# EAGLE design Button (EAGLE 7.1.0)
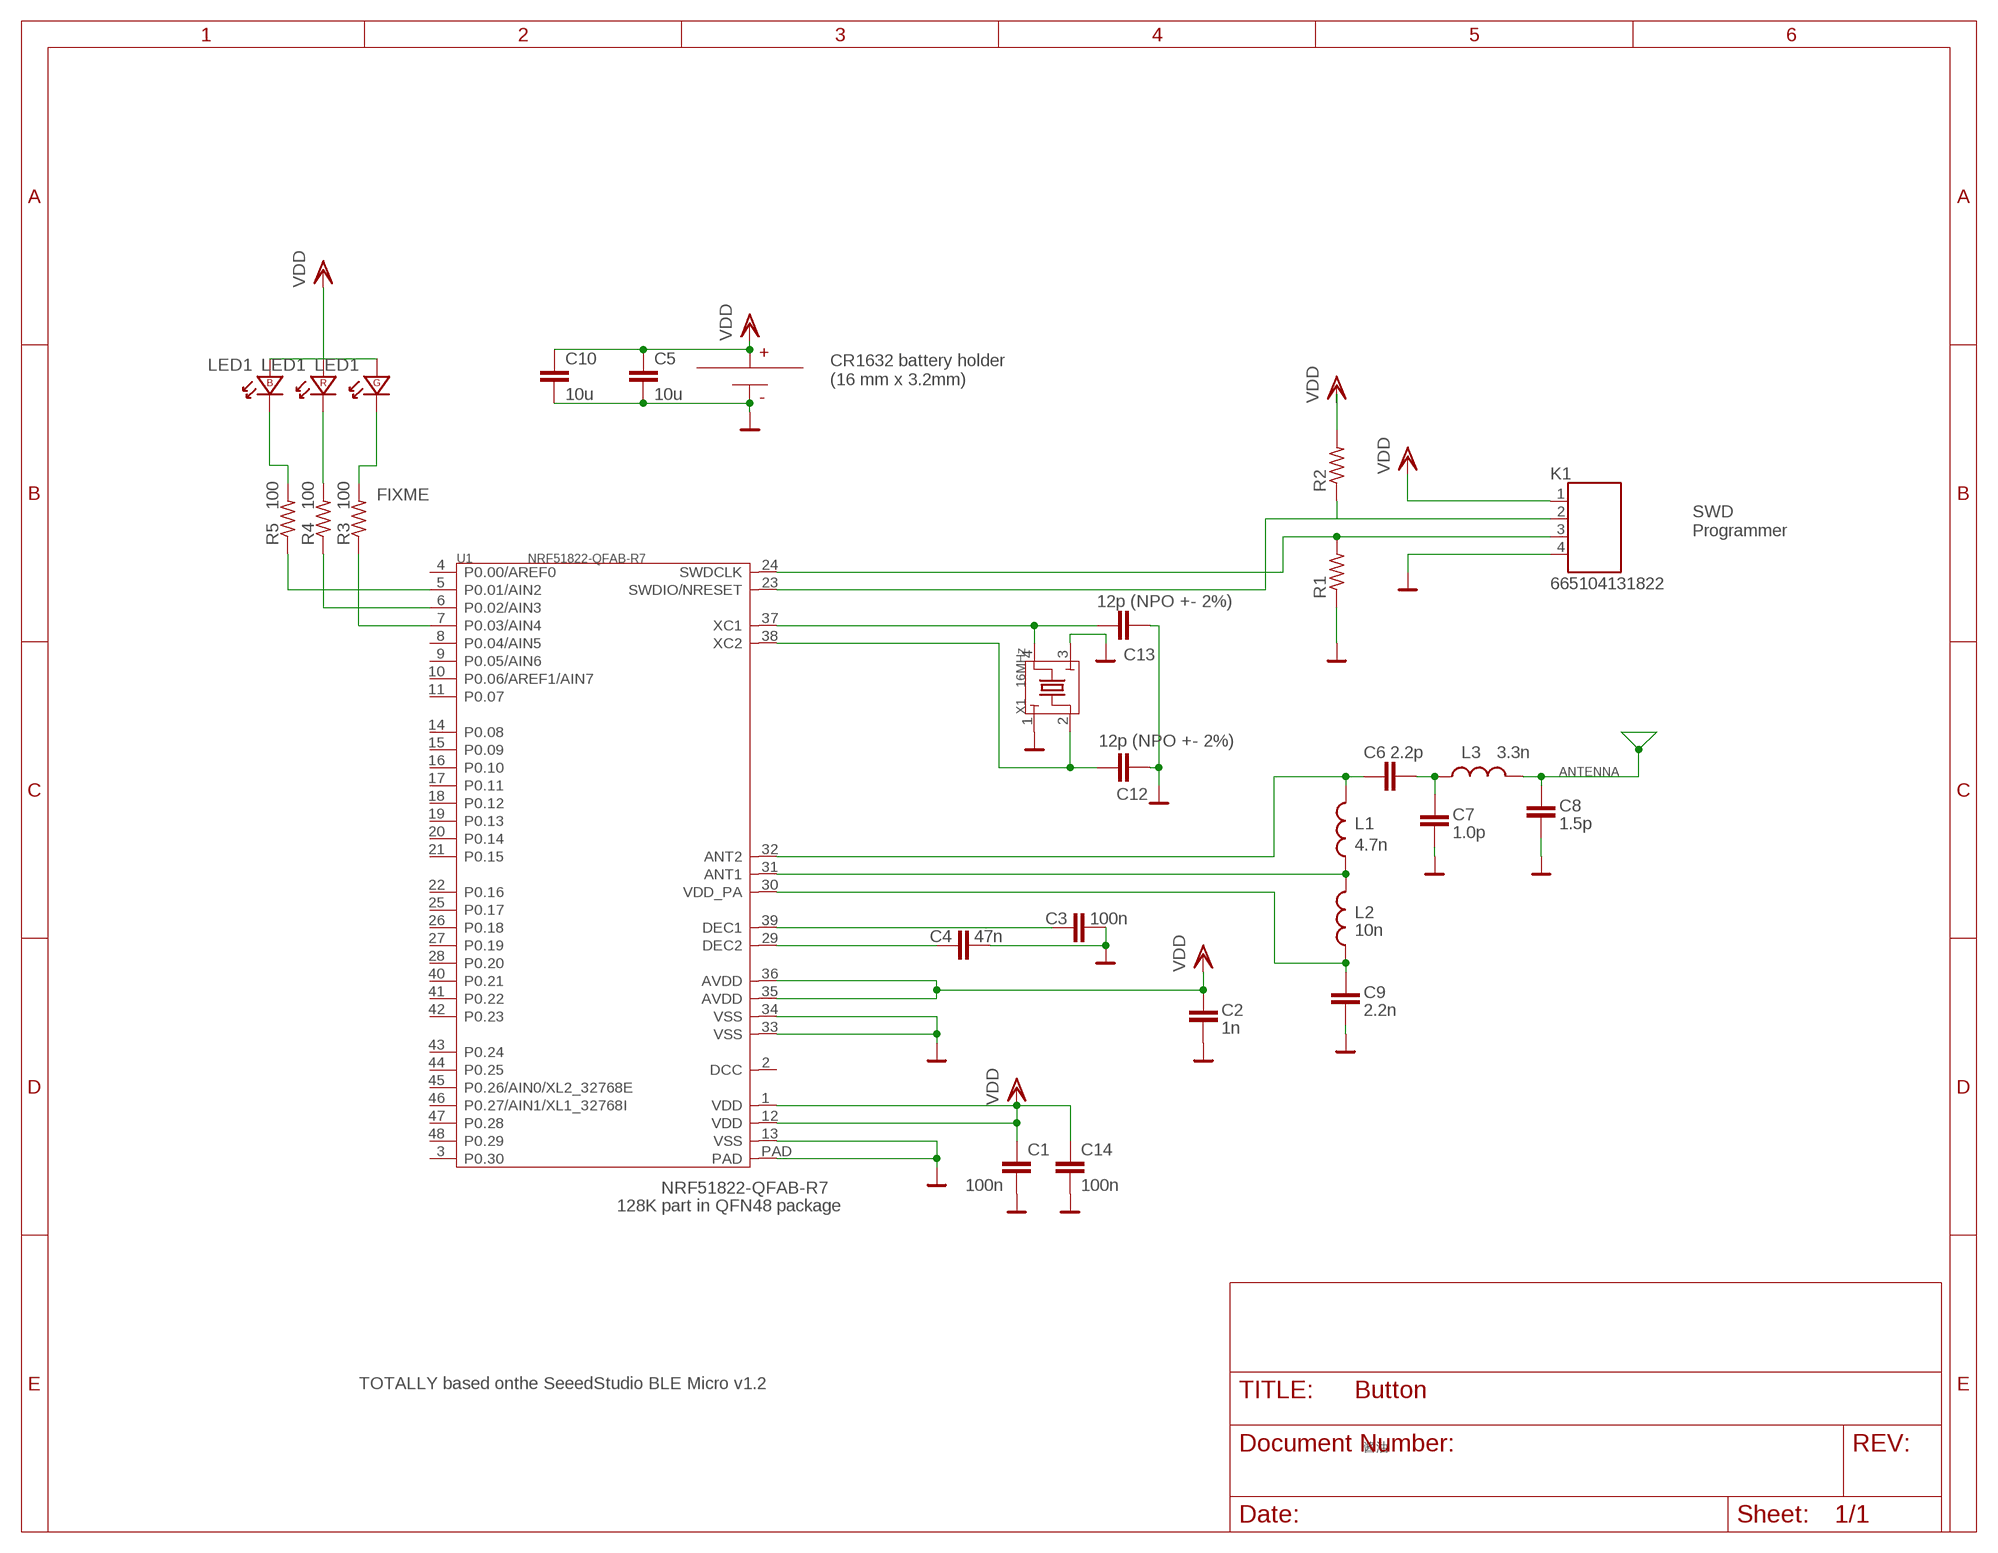
[diagram p0: schematic, sheet 1]

## Parts
B1  CON-COINCEL-HOLDER-KEYSTONE-3012TR  [16MM-COINCELL-KEYSTONE]
C1  100n  C-EU0402-C-NOSILK  [.0402-C-NOSILK]
C2  1n  C-EU0402-C-NOSILK  [.0402-C-NOSILK]
C3  100n  C-EU0402-C-NOSILK  [.0402-C-NOSILK]
C4  47n  C-EU0402-C-NOSILK  [.0402-C-NOSILK]
C5  10u  C-EU0805-B-NOSILK  [.0805-B-NOSILK]
C6  2.2p  C-EU0402-C-NOSILK  [.0402-C-NOSILK]
C7  1.0p  C-EU0402-C-NOSILK  [.0402-C-NOSILK]
C8  1.5p  C-EU0402-C-NOSILK  [.0402-C-NOSILK]
C9  2.2n  C-EU0402-C-NOSILK  [.0402-C-NOSILK]
C10  10u  C-EU0805-B-NOSILK  [.0805-B-NOSILK]
C12  12p (NPO +- 2%)  C-EU0402-C-NOSILK  [.0402-C-NOSILK]
C13  12p (NPO +- 2%)  C-EU0402-C-NOSILK  [.0402-C-NOSILK]
C14  100n  C-EU0402-C-NOSILK  [.0402-C-NOSILK]
K1  665104131822  [665104131822]
L1  4.7n  L-US0402-C-NOSILK  [.0402-C-NOSILK]
L2  10n  L-US0402-C-NOSILK  [.0402-C-NOSILK]
L3  3.3n  L-US0402-C-NOSILK  [.0402-C-NOSILK]
LED1  LED-RGB-SEPARATE-3528  [LED-3528]
R1  R-US_R0402  [R0402]
R2  R-US_R0402  [R0402]
R3  100  R-US_0402-C-NOSILK  [.0402-C-NOSILK]
R4  100  R-US_0402-C-NOSILK  [.0402-C-NOSILK]
R5  100  R-US_0402-C-NOSILK  [.0402-C-NOSILK]
U1  NRF51822-QFAB-R7  NRF51822  [QFN48-6X6MM]
X1  16MHz  CRYSTAL'-2520'  [2520]

## Nets
ANTENNA: C8.2 L3.2
GND: B1.NEG C1.2 C2.2 C3.2 C4.2 C5.2 C7.1 C8.1 C9.2 C10.2 C12.2 C13.2 C14.2 K1.4 R1.1 U1.13(VSS) U1.33(VSS) U1.34(VSS) U1.PAD X1.1 X1.3
N$1: R5.1 U1.5(P0.01/AIN2)
N$2: R4.1 U1.6(P0.02/AIN3)
N$3: R3.1 U1.7(P0.03/AIN4)
N$4: LED1.6(B:K) R5.2
N$5: LED1.5(R:K) R4.2
N$7: LED1.4(G:K) R3.2
N$9: K1.3 R1.2 U1.24(SWDCLK)
N$11: K1.2 R2.1 U1.23(SWDIO/NRESET)
N$14: R2.2
N$17: C13.1 U1.37(XC1) X1.4
N$18: C12.1 U1.38(XC2) X1.2
N$19: C3.1 U1.39(DEC1)
N$20: C4.1 U1.29(DEC2)
N$21: C6.1 L1.2 U1.32(ANT2)
N$25: L1.1 L2.2 U1.31(ANT1)
N$26: C9.1 L2.1 U1.30(VDD_PA)
N$28: C6.2 C7.2 L3.1
VDD: B1.POS@1(POS) B1.POS@2(POS) C1.1 C2.1 C5.1 C10.1 C14.1 K1.1 LED1.1(B:A) LED1.2(R:A) LED1.3(G:A) U1.1(VDD) U1.12(VDD) U1.35(AVDD) U1.36(AVDD)
Unconnected: U1.2(DCC) U1.3(P0.30) U1.4(P0.00/AREF0) U1.8(P0.04/AIN5) U1.9(P0.05/AIN6) U1.10(P0.06/AREF1/AIN7) U1.11(P0.07) U1.14(P0.08) U1.15(P0.09) U1.16(P0.10) U1.17(P0.11) U1.18(P0.12) U1.19(P0.13) U1.20(P0.14) U1.21(P0.15) U1.22(P0.16) U1.25(P0.17) U1.26(P0.18) U1.27(P0.19) U1.28(P0.20) U1.40(P0.21) U1.41(P0.22) U1.42(P0.23) U1.43(P0.24) U1.44(P0.25) U1.45(P0.26/AIN0/XL2_32768E) U1.46(P0.27/AIN1/XL1_32768I) U1.47(P0.28) U1.48(P0.29)

## Notes on the sheet
- CR1632 battery holder
  (16 mm x 3.2mm)
- FIXME
- SWD
  Programmer
- NRF51822-QFAB-R7
- 128K part in QFN48 package
- TOTALLY based onthe SeeedStudio BLE Micro v1.2
- 酱油

## Library data of the parts
B1 = 16mm-coincell-keystone:CON-COINCEL-HOLDER-KEYSTONE-3012TR
C1-C10 C12-C14 = rcl_custom:C-EU: CAPACITOR, European symbol
K1 = Wurth_Elektronik_Electromechanic_Wire_to_Board_Connectors_rev15c:665104131822: WR-WTB Wire-to-Board Connectors 1.00 mm SMT Male Horizontal Shrouded Header, 4 pins - Tape & Reel ;=>Code : Con_WTB_1_TermH_6651xx131822_665104131822 <http://katalog.we-online.de/media/images/eican/Con_WTB_1_TermH_6651xx131822_pf2.jpg> Details see: http://katalog.we-online.de/em/datasheet/6651xx131822.pdf Created 2014-10-08, Karrer Zheng 2014 (C) Wurth Elektronik
L1-L3 = rcl_custom:L-US: INDUCTOR, American symbol
LED1 = rgb-led-separate:LED-RGB-SEPARATE-*: RGB LED with separate contacts for all 3 chips
R1 R2 = adafruit:R-US_: RESISTOR, American symbol
R3-R5 = rcl_custom:R-US_: RESISTOR, American symbol
U1 = AMLib:NRF51822: Multi-protocol Blutooth 4.0 low energy /2. GHz RF SoC
X1 = AMLib:CRYSTAL

## Net classes
0 default: width 0.102 mm, drill 0.203 mm, clearance 0.102 mm

## Board
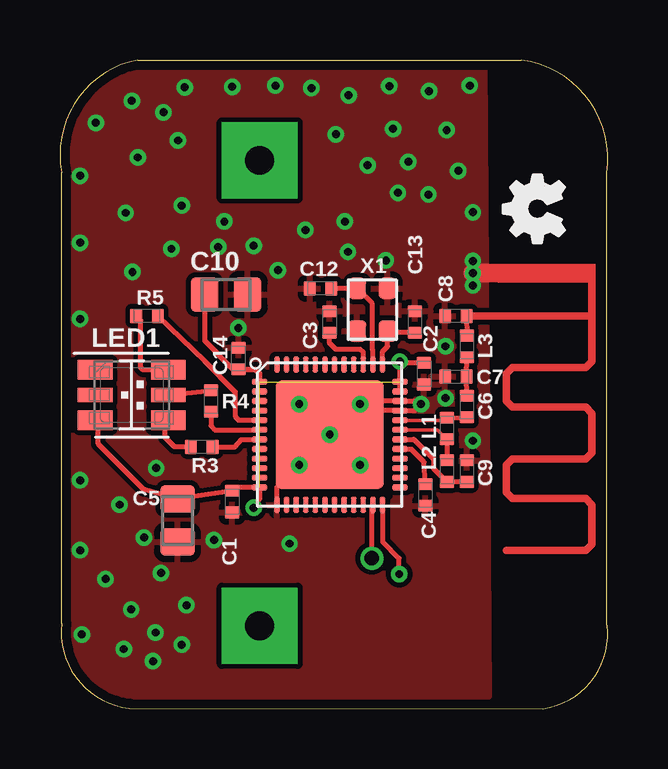
[diagram p1: board, top side]
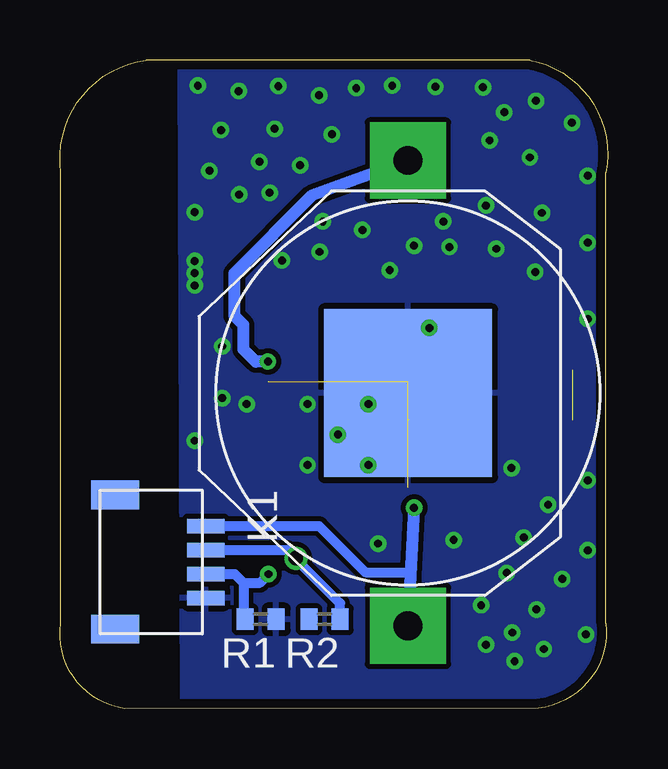
[diagram p2: board, bottom side, seen from below]

Size 22.84 x 27.05 mm. Coordinates in mm from the lower left corner, seen from the top.
Outline: 2.89,0.02 20.14,0 arc90 22.81,3.56 22.81,22.35 arc90 19.25,27.05 3.25,27.05 arc90 0.07,22.35 0.07,3.56 arc90 2.89,0.02
Copper layers (1*16): Top 0.0356mm / dielectric 1.5011mm / Bottom 0.0356mm
Design rules "OSH-Park-2-layer *": minimum track width 6mil, minimum drill 13mil, track to track 6mil, track to pad 6mil, pad to pad 6mil, via to via 6mil, smd to smd 6mil, copper to edge 15mil, drill to drill 6mil, minimum pad ring 7mil, minimum via ring 7mil, stop-mask expansion 3mil, vias tented up to drill 0mil, thermal gap 10mil
tRestrict: area 8.7,8.9 to 13.7,13.8; area 13.8,12.4 to 14.6,12.8

### Footprints (pad centres in the part's own frame; a part is rotated, then mirrored left to right if it is on the bottom)
16MM-COINCELL-KEYSTONE = smd 7 x 7: NEG 0,0 | drill 1.2 pad 3.175 square: POS@1 -9.703,0; POS@2 9.703,0
.0402-C-NOSILK = smd 0.5 x 0.6: 1 -0.45,0; 2 0.45,0
.0805-B-NOSILK = smd 1.15 x 1.45: 1 -0.9,0; 2 0.9,0
665104131822 = smd 0.6 x 1.55: 1 -1.5,0; 2 -0.5,0; 3 0.5,0; 4 1.5,0 | smd 1.2 x 2: Z1 -2.8,-3.775; Z2 2.8,-3.775
LED-3528 = smd 1.45 x 0.8: 1 -1.525,1.05; 3 -1.525,-1.05; 4 1.525,-1.05; 6 1.525,1.05 | smd 1.45 x 0.6: 2 -1.525,0; 5 1.525,0
R0402 = smd 0.7 x 0.9: 1 -0.65,0; 2 0.65,0
QFN48-6X6MM = smd 0.23 x 0.65: 1 -2.2,-2.925; 2 -1.8,-2.925; 3 -1.4,-2.925; 4 -1,-2.925; 5 -0.6,-2.925; 6 -0.2,-2.925; 7 0.2,-2.925; 8 0.6,-2.925; 9 1,-2.925; 10 1.4,-2.925; 11 1.8,-2.925; 12 2.2,-2.925; 25 2.2,2.925; 26 1.8,2.925; 27 1.4,2.925; 28 1,2.925; 29 0.6,2.925; 30 0.2,2.925; 31 -0.2,2.925; 32 -0.6,2.925; 33 -1,2.925; 34 -1.4,2.925; 35 -1.8,2.925; 36 -2.2,2.925 | smd 0.65 x 0.23: 13 2.925,-2.2; 14 2.925,-1.8; 15 2.925,-1.4; 16 2.925,-1; 17 2.925,-0.6; 18 2.925,-0.2; 19 2.925,0.2; 20 2.925,0.6; 21 2.925,1; 22 2.925,1.4; 23 2.925,1.8; 24 2.925,2.2; 37 -2.925,2.2; 38 -2.925,1.8; 39 -2.925,1.4; 40 -2.925,1; 41 -2.925,0.6; 42 -2.925,0.2; 43 -2.925,-0.2; 44 -2.925,-0.6; 45 -2.925,-1; 46 -2.925,-1.4; 47 -2.925,-1.8; 48 -2.925,-2.2 | smd 4.5 x 4.5: PAD 0,0
2520 = smd 0.889 x 0.762: 1 -0.889,0.635; 2 -0.889,-0.635; 3 0.889,-0.635; 4 0.889,0.635

### Placement (x,y rotation side)
B1  8.33,13.16 270 bottom
C1  7.18,8.64 270 top
C2  15.19,13.97 270 top
C3  11.25,16.13 90 top
C4  15.24,8.92 270 top
C5  4.9,7.85 270 top
C6  16.96,12.6 90 top
C7  16.51,13.84 0 top
C8  16.51,16.38 0 top
C9  16.96,9.91 90 top
C10  6.93,17.27 0 top
C12  10.87,17.53 180 top
C13  14.8,16.13 90 top
C14  7.44,14.6 90 top
K1  16.76,6.12 270 bottom
L1  16.14,11.68 90 top
L2  16.14,9.91 90 top
L3  16.96,15.11 90 top
LED1  2.99,13.08 0 top
R1  14.47,3.73 180 bottom
R2  11.81,3.73 180 bottom
R3  5.91,10.92 180 top
R4  6.3,12.83 90 top
R5  3.63,16.38 180 top
U1  11.25,11.43 270 top
U$31  [OSHW_FILLX100_NOTEXT]  21.03,19.43 90 top
X1  13.03,16.64 270 top

### Tracks (layer width: path | path; a pad name or v marks a point on that pad's centre or on a via)
ANTENNA
  Top 0.203: C8.2 L3.2
  Top 0.305: 19.37,16.38 C8.2 22.17,16.38 | 22.17,16.38 22.17,14.48 21.92,14.22 18.87,14.22 18.61,13.97 18.61,12.83 18.87,12.57 21.92,12.57 22.17,12.32 22.17,10.67 21.92,10.41 18.87,10.41 18.61,10.16 18.61,9.02 18.87,8.76 21.92,8.76 22.17,8.51 22.17,6.86 21.92,6.6 18.61,6.6 | 22.17,16.38 22.17,18.29
GND  (via drill 0.33 pad 0.61)
  Top 0.152: 13.16,12.83 13.15,12.83 | 13.17,12.43 13.15,12.45 | 14.8,12.83 14.93,12.7 14.93,12.57
  Top 0.203: 13.16,12.83 U1.34 14.8,12.83 | 13.17,12.43 U1.33 14.79,12.43 14.93,12.57 | U1.13 9.05,9.23 v9.98,10.16
  Top 0.762: 18.87,18.16 v17.22,18.16
  other vias: 12.01,19.05 7.44,15.88 4.21,5.66 11.25,11.43 15.06,12.7 17.22,11.18 12.52,10.16 12.52,12.7 9.98,12.7 12.82,22.66 17.22,18.67 17.22,17.65 13.59,18.69 2.97,4.14 15.36,21.44 16.07,15.11 16.07,12.95 12.04,25.58 3.88,1.98 15.39,25.76 16.13,24.13 3.98,3.17 5.28,4.32 0.91,3.1 0.83,6.6 0.83,9.53 2.49,8.51 0.83,16.26 0.83,22.22 7.18,25.93 4.31,24.87 13.89,24.18 16.61,22.43 17.22,20.7 1.9,5.41 6.42,7.04 0.83,19.43 3.25,22.99 9.09,18.29 4.64,19.18 4.01,10.03 11.88,20.32 8.07,19.3 3.5,7.14 5.08,2.67 2.66,2.49 5.2,25.91 2.99,25.35 1.5,24.43 2.74,20.68 4.92,23.7 3.02,18.21 5.08,20.98 6.85,20.32 8.99,25.98 10.23,19.96 6.6,19.25 10.49,25.88 13.74,25.96 17.09,25.98 11.5,23.95 14.53,22.81 14.09,21.51 9.57,6.88
  pour Top (isolate 0.203, rank 5): 17.73,27.05 17.9,0.48 0.17,0.48 0.2,27.05
  pour Bottom (isolate 0.203, rank 5): 17.85,27.05 17.75,0.03 0.38,0.03 0.33,27.05
N$1  (1 unrouted)
  Top 0.203: R5.1 6.04,14.48 7.31,13.21 7.31,12.19 7.44,12.04 8.29,12.04
N$2
  Top 0.203: R4.1 6.3,11.81 6.45,11.63 8.29,11.63 U1.6
N$3
  Top 0.203: R3.1 7.31,10.92 7.57,11.23 8.27,11.23 U1.7
N$4
  Top 0.203: LED1.6 3.47,14.13 3.37,14.22 3.37,16.19 R5.2
N$5
  Top 0.203: LED1.5 R4.2
N$7
  Top 0.203: R3.2 4.77,10.92 4.39,11.3 4.39,11.9
  Top 0.406: 4.39,11.9 LED1.4
N$9  (via drill 0.33)
  Top 0.203: v14.14,5.61 14.14,6.27 13.46,6.96 U1.24
  Bottom 0.406: K1.3 15.55,5.62 15.19,5.26 | 15.19,5.26 15.19,3.79 R1.2 | 15.19,5.26 14.5,5.26 v14.14,5.61
N$11  (via drill 0.33, 0.6)
  Top 0.203: v13,6.27 13,8.46 U1.23
  Bottom 0.406: K1.2 13.37,6.62 | 13.37,6.62 v13.05,6.3 11.16,4.4 R2.1 | 13.37,6.62 13.35,6.62 v13,6.27
N$17
  Top 0.203: U1.37 13.45,14.9 13.66,15.11 X1.4 13.73,15.68 C13.1
N$18
  Top 0.152: 11.58,17.53 C12.1 | 13.05,14.96 13.03,14.99
  Top 0.203: 13.03,14.99 13.03,16.89 X1.2 11.58,17.53 | U1.38 13.05,14.96
N$19
  Top 0.203: U1.39 12.65,14.86 12.52,14.99 11.5,14.99 11.25,15.24 C3.1
N$20
  Top 0.203: C4.1 15.19,10.29 14.64,10.83 U1.29
N$21
  Top 0.152: U1.32 16.03,12.03 L1.2
  Top 0.203: L1.2 C6.1
N$25
  Top 0.152: U1.31 15.73,11.63 L1.1
  Top 0.203: L1.1 L2.2
N$26
  Top 0.203: C9.1 L2.1 15.57,10.02 15.57,10.41 14.75,11.23 U1.30
N$28
  Top 0.203: C6.2 C7.2 L3.1
VDD  (via drill 0.33, 0.33 pad 0.61)  (4 unrouted)
  Top 0.203: v8.07,8.38 8.32,8.76 U1.12 7.33,9.23 C1.1 C5.1 3.49,9.15 1.6,11.05 1.6,11.9 LED1.3 | U1.35 U1.36 14.17,14.35 v14.17,14.48 | C2.1 14.23,14.42 | C14.1 7.23,14.15 6.04,15.34 C10.1
  Top 0.229: U1.1 8.32,13.97 8.14,14.15 C14.1
  Top 0.508: 14.23,14.42 v14.17,14.48
  Bottom 0.406: K1.1 12.04,7.62 10.11,5.69 8.32,5.69 8.22,5.58
  Bottom 0.508: v8.07,8.38 8.22,5.58 B1.POS@2 | v14.17,14.48 14.68,14.48 15.19,14.99 15.19,16 15.57,16.38 15.57,18.16 12.34,21.39 B1.POS@1
(copper drawn outside any net)
  shapes: Top area x1